# EAGLE design BLE-Shield-2_0_0_A1 (EAGLE 6.4)
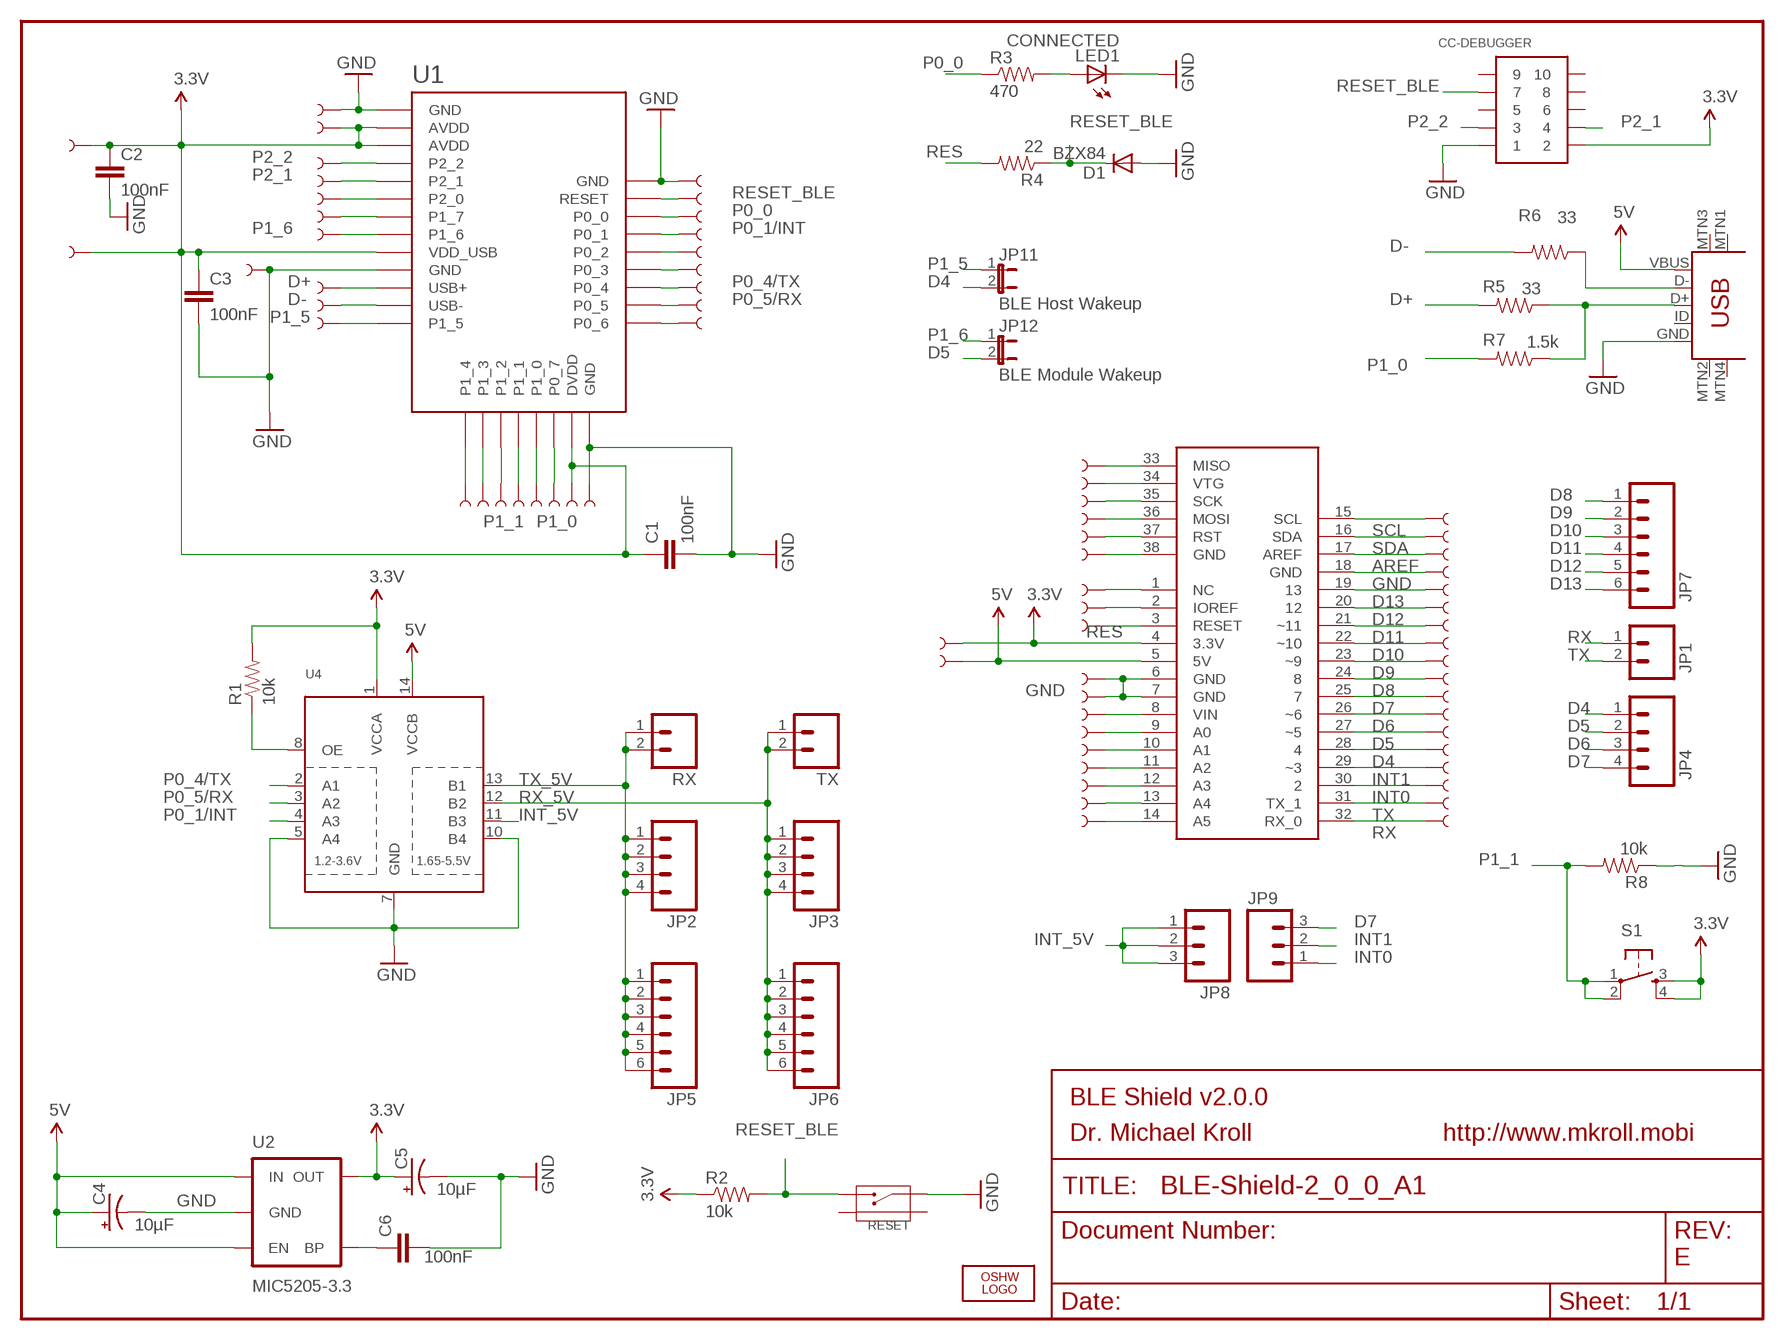
[diagram p0: schematic, sheet 1]

## Parts
C1  100nF  CAP0603-CAP  [0603-CAP]
C2  100nF  CAP0603-CAP  [0603-CAP]
C3  100nF  CAP0603-CAP  [0603-CAP]
C4  10µF  CAP_POL1206  [EIA3216]
C5  10µF  CAP_POL1206  [EIA3216]
C6  100nF  CAP0603-CAP  [0603-CAP]
CC-DEBUGGER  CONN_5-2-FTSH-V  [FTSH-105-DV]
D1  BZX84  DIODESOT23  [SOT23-3]
JP1  M02PTH  [1X02]
JP2  M04PTH  [1X04]
JP3  M04PTH  [1X04]
JP4  M04PTH  [1X04]
JP5  M06SIP  [1X06]
JP6  M06SIP  [1X06]
JP7  M06SIP  [1X06]
JP8  M03PTH  [1X03]
JP9  M03PTH  [1X03]
JP11  BLE Host Wakeup  JUMPER-2SMD-NO-NS  [SJ_2S-NO-NS]
JP12  BLE Module Wakeup  JUMPER-2SMD-NO-NS  [SJ_2S-NO-NS]
LED1  CONNECTED  LED0603  [LED-0603]
LOGO1  LOGO-OSHW-FILLX0200-NT  [OSHW_FILLX200_NOTEXT]
R1  10k  RESISTOR0603-RES  [0603-RES]
R2  10k  RESISTOR0603-RES  [0603-RES]
R3  470  RESISTOR0603-RES  [0603-RES]
R4  22  RESISTOR0603-RES  [0603-RES]
R5  33  RESISTOR0603-RES  [0603-RES]
R6  33  RESISTOR0603-RES  [0603-RES]
R7  1.5k  RESISTOR0603-RES  [0603-RES]
R8  10k  RESISTOR0603-RES  [0603-RES]
RESET  BUTTON-2P-REINFORCE-3100060P1  [4P-SMD-7.0X3.5X3.5H-90D]
RX  M02PTH  [1X02]
S1  TAC_SWITCHSMD  [TACTILE_SWITCH_SMD]
TP1  TEST-POINT3X5  [PAD.03X.05]
TP2  TEST-POINT3X5  [PAD.03X.05]
TP3  TEST-POINT3X5  [PAD.03X.05]
TP4  TEST-POINT3X5  [PAD.03X.05]
TP5  TEST-POINT3X5  [PAD.03X.05]
TP6  TEST-POINT3X5  [PAD.03X.05]
TP7  TEST-POINT3X5  [PAD.03X.05]
TP8  TEST-POINT3X5  [PAD.03X.05]
TP9  TEST-POINT3X5  [PAD.03X.05]
TP10  TEST-POINT3X5  [PAD.03X.05]
TP11  TEST-POINT3X5  [PAD.03X.05]
TP12  TEST-POINT3X5  [PAD.03X.05]
TP13  TEST-POINT3X5  [PAD.03X.05]
TP14  TEST-POINT3X5  [PAD.03X.05]
TP15  TEST-POINT3X5  [PAD.03X.05]
TP16  TEST-POINT3X5  [PAD.03X.05]
TP17  TEST-POINT3X5  [PAD.03X.05]
TP18  TEST-POINT3X5  [PAD.03X.05]
TP19  TEST-POINT3X5  [PAD.03X.05]
TP20  TEST-POINT3X5  [PAD.03X.05]
TP21  TEST-POINT3X5  [PAD.03X.05]
TP22  TEST-POINT3X5  [PAD.03X.05]
TP23  TEST-POINT3X5  [PAD.03X.05]
TP24  TEST-POINT3X5  [PAD.03X.05]
TP25  TEST-POINT3X5  [PAD.03X.05]
TP26  TEST-POINT3X5  [PAD.03X.05]
TP27  TEST-POINT3X5  [PAD.03X.05]
TP28  TEST-POINT3X5  [PAD.03X.05]
TP29  TEST-POINT3X5  [PAD.03X.05]
TP30  TEST-POINT3X5  [PAD.03X.05]
TP31  TEST-POINT3X5  [PAD.03X.05]
TP32  TEST-POINT3X5  [PAD.03X.05]
TP33  TEST-POINT3X5  [PAD.03X.05]
TP34  TEST-POINT3X5  [PAD.03X.05]
TP35  TEST-POINT3X5  [PAD.03X.05]
TP36  TEST-POINT3X5  [PAD.03X.05]
TP37  TEST-POINT3X5  [PAD.03X.05]
TP38  TEST-POINT3X5  [PAD.03X.05]
TP39  TEST-POINT3X5  [PAD.03X.05]
TP40  TEST-POINT3X5  [PAD.03X.05]
TP41  TEST-POINT3X5  [PAD.03X.05]
TP42  TEST-POINT3X5  [PAD.03X.05]
TP43  TEST-POINT3X5  [PAD.03X.05]
TP44  TEST-POINT3X5  [PAD.03X.05]
TP45  TEST-POINT3X5  [PAD.03X.05]
TP46  TEST-POINT3X5  [PAD.03X.05]
TP47  TEST-POINT3X5  [PAD.03X.05]
TP48  TEST-POINT3X5  [PAD.03X.05]
TP49  TEST-POINT3X5  [PAD.03X.05]
TP50  TEST-POINT3X5  [PAD.03X.05]
TP51  TEST-POINT3X5  [PAD.03X.05]
TP52  TEST-POINT3X5  [PAD.03X.05]
TP53  TEST-POINT3X5  [PAD.03X.05]
TP54  TEST-POINT3X5  [PAD.03X.05]
TP55  TEST-POINT3X5  [PAD.03X.05]
TP56  TEST-POINT3X5  [PAD.03X.05]
TP57  TEST-POINT3X5  [PAD.03X.05]
TP58  TEST-POINT3X5  [PAD.03X.05]
TP59  TEST-POINT3X5  [PAD.03X.05]
TP60  TEST-POINT3X5  [PAD.03X.05]
TP61  TEST-POINT3X5  [PAD.03X.05]
TP62  TEST-POINT3X5  [PAD.03X.05]
TP63  TEST-POINT3X5  [PAD.03X.05]
TP64  TEST-POINT3X5  [PAD.03X.05]
TP65  TEST-POINT3X5  [PAD.03X.05]
TP66  TEST-POINT3X5  [PAD.03X.05]
TP67  TEST-POINT3X5  [PAD.03X.05]
TP68  TEST-POINT3X5  [PAD.03X.05]
TX  M02PTH  [1X02]
U1  BLE112-A-VISUAL  [BLE112-A]
U2  MIC5205-3.3  V_REG_LDOSMD  [SOT23-5]
U4  TXB0104PWR  [TSSOP14]
U$5  ARDUINO_UNO_SHIELD_ICSP_PADS_ONLY  [ICSP_PADS_ONLY]
U$6  USB-MINIB-5PIN  [USB-MINIB]

## Nets
3.3V: C1.1 C2.1 C3.1 C5.A(+) CC-DEBUGGER.2 R1.2 R2.1 S1.3 S1.4 TP29.P$1 TP45.P$1 TP57.P$1 TP58.P$1 TP64.P$1 U1.AVDD1(AVDD) U1.AVDD2(AVDD) U1.DVDD U1.VDD_USB U2.5(OUT) U4.1(VCCA) U$5.4(3.3V)
5V: C4.A(+) TP46.P$1 U2.1(IN) U2.3(EN) U4.14(VCCB) U$5.5(5V) U$6.VBUS
AREF: TP3.P$1 U$5.17(AREF)
D4: JP4.1 JP11.2 TP14.P$1 U$5.28
D5: JP4.2 JP12.2 TP13.P$1 U$5.27(~5)
D6: JP4.3 TP12.P$1 U$5.26(~6)
D7: JP4.4 JP9.3 TP11.P$1 U$5.25
D8: JP7.1 TP10.P$1 U$5.24
D9: JP7.2 TP9.P$1 U$5.23(~9)
D10: JP7.3 TP8.P$1 U$5.22(~10)
D11: JP7.4 TP7.P$1 U$5.21(~11)
D12: JP7.5 TP6.P$1 U$5.20
D13: JP7.6 TP5.P$1 U$5.19
D+: R5.2 TP66.P$1 U1.USB+
D-: R6.2 TP67.P$1 U1.USB-
GND: C1.2 C2.2 C3.2 C4.C(-) C5.C(-) C6.2 CC-DEBUGGER.1 D1.1(A) LED1.C R8.1 RESET.1 TP4.P$1 TP19.P$1 TP28.P$1 TP47.P$1 TP48.P$1 TP54.P$1 TP65.P$1 U1.GND1(GND) U1.GND2(GND) U1.GND3(GND) U1.GND4(GND) U2.2(GND) U4.5(A4) U4.7(GND) U4.10(B4) U$5.6(GND) U$5.7(GND) U$5.18(GND) U$6.GND
INT0: JP9.1 TP16.P$1 U$5.30
INT1: JP9.2 TP15.P$1 U$5.29(~3)
INT_5V: JP8.1 JP8.2 JP8.3 U4.11(B3)
N$1: TP53.P$1 U$5.12(A3)
N$2: C6.1 U2.4(BP)
N$3: TP56.P$1 U$5.14(A5)
N$4: LED1.A R3.2
N$5: TP55.P$1 U$5.13(A4)
N$6: TP52.P$1 U$5.11(A2)
N$7: TP51.P$1 U$5.10(A1)
N$8: TP50.P$1 U$5.9(A0)
N$9: TP49.P$1 U$5.8(VIN)
N$12: R5.1 R7.1 U$6.D+
N$13: TP43.P$1 U$5.2(IOREF)
N$14: TP27.P$1 U1.P0_6
N$15: TP35.P$1 U1.P1_4
N$16: TP24.P$1 U1.P0_3
N$17: TP23.P$1 U1.P0_2
N$18: TP42.P$1 U$5.1(NC)
N$19: TP34.P$1 U1.P1_3
N$20: TP33.P$1 U1.P1_2
N$23: TP30.P$1 U1.P0_7
N$24: TP41.P$1 U$5.38(GND)
N$25: TP40.P$1 U$5.37(RST)
N$26: TP39.P$1 U$5.36(MOSI)
N$27: TP38.P$1 U$5.35(SCK)
N$28: TP37.P$1 U$5.34(VTG)
N$29: TP36.P$1 U$5.33(MISO)
N$30: R6.1 U$6.D-
N$31: TP61.P$1 U1.P2_0
N$32: TP62.P$1 U1.P1_7
N$37: R1.1 U4.8(OE)
P0_0: R3.1 TP21.P$1 U1.P0_0
P0_1/INT: TP22.P$1 U1.P0_1 U4.4(A3)
P0_4/TX: TP25.P$1 U1.P0_4 U4.2(A1)
P0_5/RX: TP26.P$1 U1.P0_5 U4.3(A2)
P1_0: R7.2 TP31.P$1 U1.P1_0
P1_1: R8.2 S1.1 S1.2 TP32.P$1 U1.P1_1
P1_5: JP11.1 TP68.P$1 U1.P1_5
P1_6: JP12.1 TP63.P$1 U1.P1_6
P2_1: CC-DEBUGGER.4 TP60.P$1 U1.P2_1
P2_2: CC-DEBUGGER.3 TP59.P$1 U1.P2_2
RES: R4.2 TP44.P$1 U$5.3(RESET)
RESET_BLE: CC-DEBUGGER.7 D1.3(C) R2.2 R4.1 RESET.2 TP20.P$1 U1.RESET
RX: JP1.1 TP18.P$1 U$5.32(RX_0)
RX_5V: JP3.1 JP3.2 JP3.3 JP3.4 JP6.1 JP6.2 JP6.3 JP6.4 JP6.5 JP6.6 TX.1 TX.2 U4.12(B2)
SCL: TP1.P$1 U$5.15(SCL)
SDA: TP2.P$1 U$5.16(SDA)
TX: JP1.2 TP17.P$1 U$5.31(TX_1)
TX_5V: JP2.1 JP2.2 JP2.3 JP2.4 JP5.1 JP5.2 JP5.3 JP5.4 JP5.5 JP5.6 RX.1 RX.2 U4.13(B1)
Unconnected: CC-DEBUGGER.5 CC-DEBUGGER.6 CC-DEBUGGER.8 CC-DEBUGGER.9 CC-DEBUGGER.10 RESET.S1 RESET.S2 U$6.ID U$6.MTN1(MTN2) U$6.MTN2(MTN3) U$6.MTN3(MTN1) U$6.MTN4

## Notes on the sheet
- BLE Shield v2.0.0
- Dr. Michael Kroll | http://www.mkroll.mobi
- E

## Library data of the parts
C1-C3 C6 = SparkFun-Capacitors:CAP: Capacitor Standard 0603 ceramic capacitor, and 0.1" leaded capacitor.
C4 C5 = SparkFun:CAP_POL: Capacitor Polarized These are standard SMD and PTH capacitors. Normally 10uF, 47uF, and 100uF in electrolytic and tantalum varieties. Always verify the external diameter of the through hole cap, it varies with capacity, voltage, and manufacturer. The EIA devices should be standard.
CC-DEBUGGER = pel_misc:CONN_5-2
D1 = SparkFun-DiscreteSemi:DIODE: Diode These are standard reverse protection diodes and small signal diodes. SMA package can handle up to about 1A. SOD-323 can handle about 200mA. What the SOD-323 package when ordering, there are some mfgs out there that are 5-pin packages.
JP1 RX TX = SparkFun-Connectors:M02: Header 2 Standard 2-pin 0.1" header. Use with straight break away headers (SKU : PRT-00116), right angle break away headers (PRT-00553), swiss pins (PRT-00743), machine pins (PRT-00117), and female headers (PRT-00115). Molex polarized connector foot print use with SKU : PRT-08233 with associated crimp pins and housings.
JP2-JP4 = SparkFun-Connectors:M04: Header 4 Standard 4-pin 0.1" header. Use with straight break away headers (SKU : PRT-00116), right angle break away headers (PRT-00553), swiss pins (PRT-00743), machine pins (PRT-00117), and female headers (PRT-00115). Molex polarized connector foot print use with SKU : PRT-08231 with associated crimp pins and housings. 1MM SMD Version SKU: PRT-10208
JP5-JP7 = SparkFun-Connectors:M06: Header 6 Standard 6-pin 0.1" header. Use with straight break away headers (SKU : PRT-00116), right angle break away headers (PRT-00553), swiss pins (PRT-00743), machine pins (PRT-00117), and female headers (PRT-00115). Molex polarized connector foot print use with SKU : PRT-08094 with associated crimp pins and housings. NOTES ON THE VARIANTS LOCK and LOCK_LONGPADS... This footprint was designed to help hold the alignment of a through-hole component (i.e. 6-pin header) while soldering it into place. You may notice that each hole has been shifted either up or down by 0.005 of an inch from it's more standard position (which is a perfectly straight line). This slight alteration caused the pins (the squares in the middle) to touch the edges of the holes. Because they are alternating, it causes a "brace" to hold the component in place. 0.005 has proven to be the perfect amount of "off-center" position when using our standard breakaway headers. Although looks a little odd when you look at the bare footprint, once you have a header in there, the alteration is very hard to notice. Also, if you push a header all the way into place, it is covered up entirely on the bottom side. This idea of altering the position of holes to aid alignment will be further integrated into the Sparkfun Library for other footprints. It can help hold any component with 3 or more connection pins.
JP8 JP9 = SparkFun-Connectors:M03: Header 3 Standard 3-pin 0.1" header. Use with straight break away headers (SKU : PRT-00116), right angle break away headers (PRT-00553), swiss pins (PRT-00743), machine pins (PRT-00117), and female headers (PRT-00115). Molex polarized connector foot print use with SKU : PRT-08232 with associated crimp pins and housings.
JP11 JP12 = SparkFun-Passives:JUMPER-2: Jumper Basic 0.1" spaced jumper. Use with breakaway headers.
LED1 = SparkFun-LED:LED: LEDs Standard schematic elements and footprints for 5mm, 3mm, 1206, and 0603 sized LEDs. 5mm - Spark Fun Electronics SKU : COM-00529 (and others)
LOGO1 = Logo:LOGO-OSHW-FILL
R1-R8 = SparkFun-Resistors:RESISTOR: Resistor Basic schematic elements and footprints for 0603, 1206, and PTH resistors.
RESET = OPL:BUTTON-2P-REINFORCE: TS-1188E http://www.best-dz.com/?thread-374-2.html SMD Button
S1 = SparkFun-Electromechanical:TAC_SWITCH: Momentary Switch Button commonly used for reset or general input. Spark Fun Electronics SKU : COM-00097 SMT- SWCH-08247; PROD_ID: SWCH-08247
TP1-TP68 = SparkFun-Passives:TEST-POINT: Bare copper test points for troubleshooting or ICT
U1 = sf-bluegiga:BLE112-A-VISUAL: Bluetooth Low Energy single-mode module - Bluetooth 4.0, chip antenna
U2 = SparkFun:V_REG_LDO: Voltage Regulator LDO Standard 150mA LDO voltage regulator in SOT-23 layout. Micrel part MIC5205. BP (by-pass) pin is used to lower output noise with 470pF cap.
U4 = SparkFun-DigitalIC:TXB0104PWR: 4-Bit Bi-Directional Level Shifter 1.2V-3.6V (VCCA) to 1.65V-5.5V (VCCB) bi-directional level shifter with auto direction sensing. Max data rate - VCCA 1.8V: 20Mbps (50ns), VCCA 3.3V: 100Mbps (10ns) Digikey: 296-21929-1-ND
U$5 = Arduino_Shields:ARDUINO_UNO_SHIELD_ICSP: Arduino Uno R3 Shield with ICSP header.
U$6 = SparkFun-Connectors:USB-MINIB: Mini-USB "B" connector with 5th pin broken out. Created new symbol breaking out 5th "ID" pin in mini/micro USB connector spec. See: http://en.wikipedia.org/wiki/Mini_usb#Cables. Uses same footprint as 4-pin symbol. Also added pins to connect to mounting / shield pads if required (probably not generally needed as signals aren't shielded once they leave the connector).

## Board
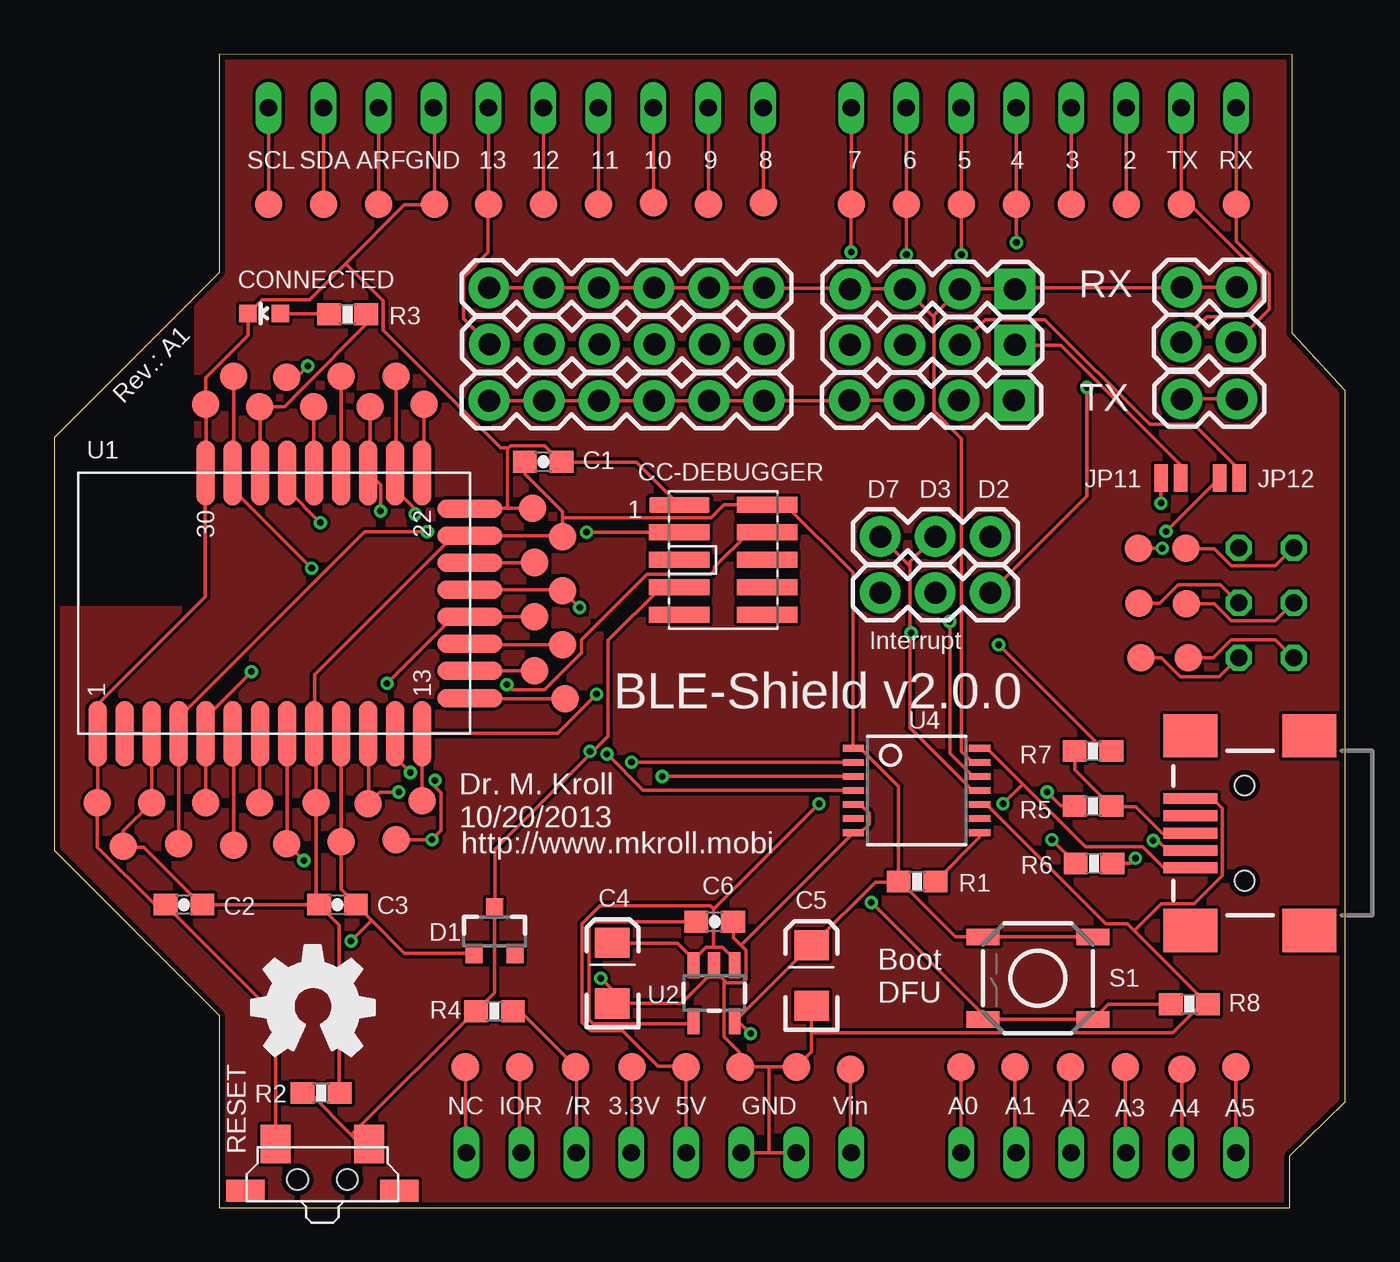
[diagram p1: board, top side]
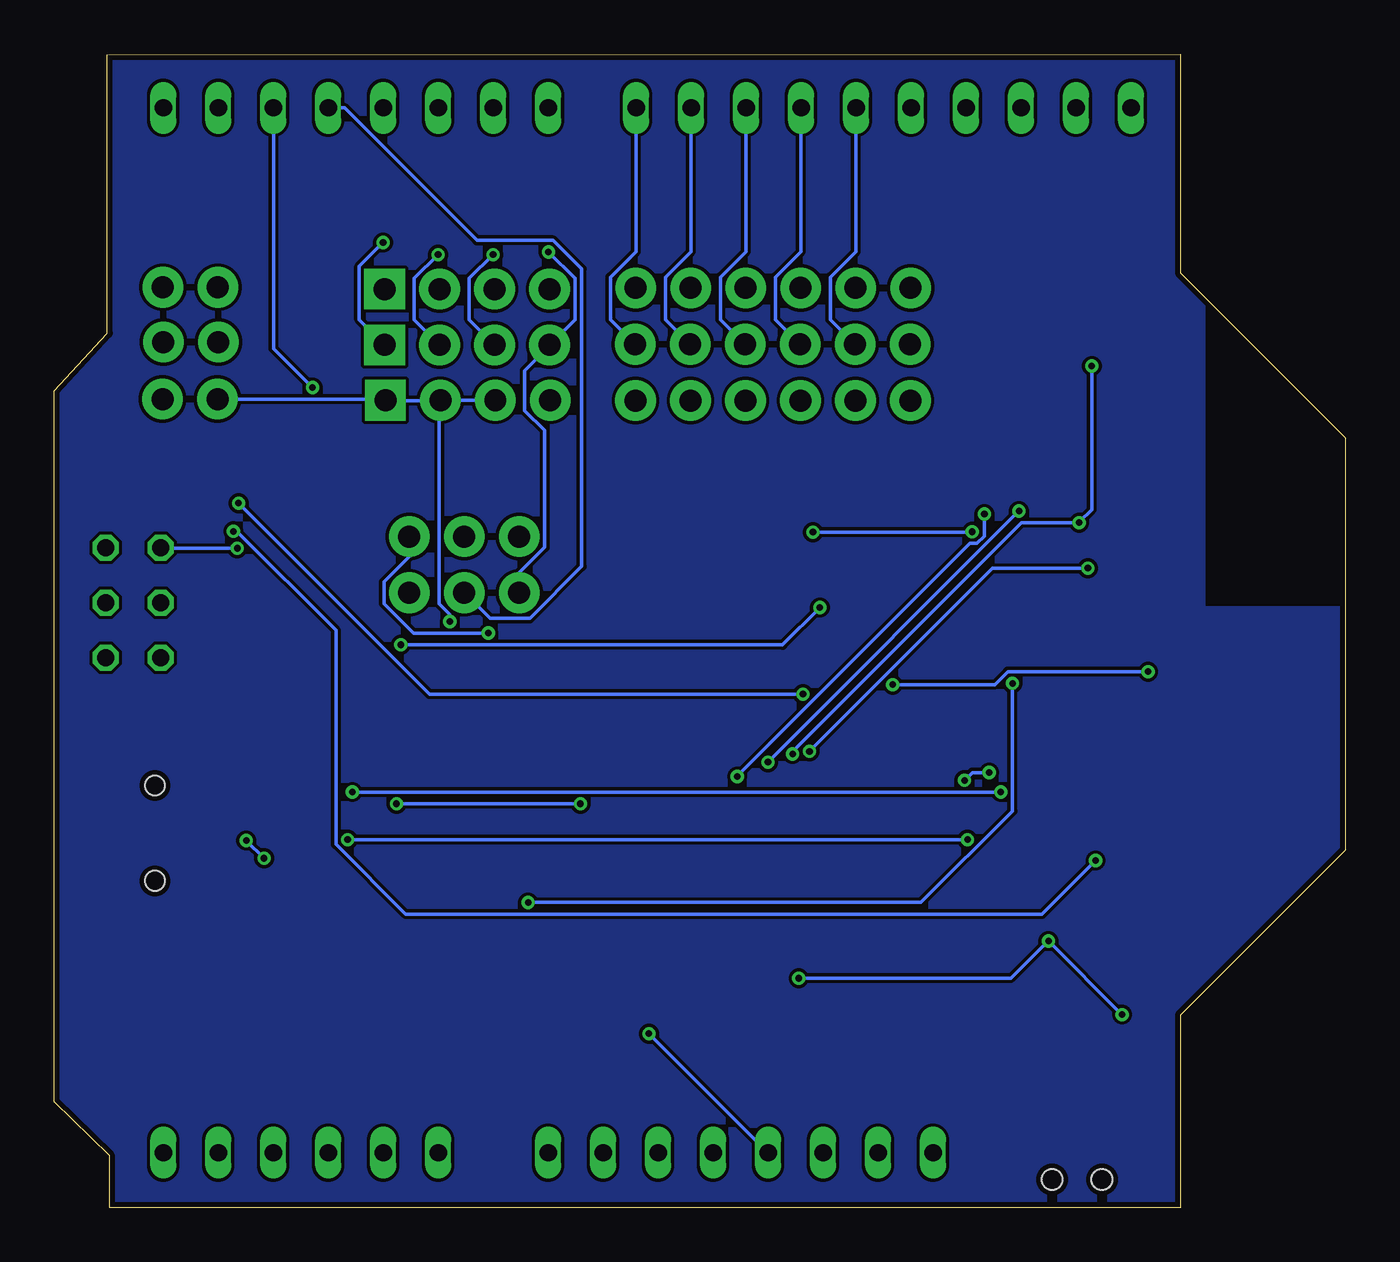
[diagram p2: board, bottom side, seen from below]

Size 59.66 x 53.28 mm. Coordinates in mm from the lower left corner, seen from the top.
Outline: 7.62,0 57.1,0 57.1,2.4 59.66,4.9 59.66,37.73 57.2,40.4 57.2,53.25 7.62,53.28 7.62,43.18 0,35.56 0,16.51 7.62,8.89 7.62,0
Copper layers (1*2*15*16): Top 0.035mm / dielectric 0.2mm / layer 2 0.0175mm / dielectric 1.1mm / layer 15 0.0175mm / dielectric 0.2mm / Bottom 0.035mm
Design rules "SeeedStudio_DRU_no_angle_20130527": minimum track width 6mil, minimum drill 12mil, track to track 6mil, track to pad 6mil, pad to pad 6mil, via to via 6mil, smd to smd 0mil, copper to edge 10mil, drill to drill 10mil, minimum pad ring 6mil, minimum via ring 6mil, stop-mask expansion 2mil, vias tented up to drill 25mil, thermal gap 10mil
tKeepout: area 0.1,23.6 to 17.5,32.2
bKeepout: area 0.1,23.6 to 17.5,32.2
tRestrict: area 0,27.8 to 6.5,42
bRestrict: area 0,27.8 to 6.5,41.9

### Footprints (pad centres in the part's own frame; a part is rotated, then mirrored left to right if it is on the bottom)
0603-CAP = smd 1.1 x 1: 1 -0.85,0; 2 0.85,0
EIA3216 = smd 1.4 x 1.6: A 1.4,0; C -1.4,0
FTSH-105-DV = smd 0.74 x 2.8: 1 -2.54,-2.03; 2 -2.54,2.03; 3 -1.27,-2.03; 4 -1.27,2.03; 5 0,-2.03; 6 0,2.03; 7 1.27,-2.03; 8 1.27,2.03; 9 2.54,-2.03; 10 2.54,2.03
SOT23-3 = smd 0.8 x 0.9: 1 -0.95,-1; 2 0.95,-1; 3 0,1.1
1X02 = drill 1.016 pad 1.88: 1 0,0; 2 2.54,0
1X04 = drill 1.016 pad 1.88 square: 1 0,0 | drill 1.016 pad 1.88: 2 2.54,0; 3 5.08,0; 4 7.62,0
1X06 = drill 1.016 pad 1.88: 1 0,0; 2 2.54,0; 3 5.08,0; 4 7.62,0; 5 10.16,0; 6 12.7,0
1X03 = drill 1.016 pad 1.88: 1 0,0; 2 2.54,0; 3 5.08,0
SJ_2S-NO-NS = smd 0.635 x 1.27: 1 -0.45,0; 2 0.45,0
LED-0603 = smd 0.8 x 0.8: A 0,-0.75; C 0,0.75
0603-RES = smd 1.1 x 1: 1 -0.85,0; 2 0.85,0
4P-SMD-7.0X3.5X3.5H-90D = smd 1.397 x 1.778: 1 -2.159,1.651; 2 2.159,1.651 | smd 1.778 x 1.016: S1 -3.556,-0.508; S2 3.556,-0.508 | hole 0.95: -1.15,0; 1.15,0
TACTILE_SWITCH_SMD = smd 1.524 x 0.762: 1 -2.54,1.905; 2 2.54,1.905; 3 -2.54,-1.905; 4 2.54,-1.905
PAD.03X.05 = smd 1.27 x 1.27: P$1 0,0
BLE112-A = smd 3 x 0.85: AVDD1 -6.05,6.9; AVDD2 -6.05,5.65; GND1 -6.05,8.15; GND2 -6.05,-3.1; GND4 6,3.15; P0_0 6,0.65; P0_1 6,-0.6; P0_2 6,-1.85; P0_3 6,-3.1; P0_4 6,-4.35; P0_5 6,-5.6; P0_6 6,-6.85; P1_5 -6.05,-6.85; P1_6 -6.05,-0.6; P1_7 -6.05,0.65; P2_0 -6.05,1.9; P2_1 -6.05,3.15; P2_2 -6.05,4.4; RESET 6,1.9; USB+ -6.05,-4.35; USB- -6.05,-5.6; VDD_USB -6.05,-1.85 | smd 0.85 x 3: DVDD 3.1,-9.05; GND3 4.35,-9.05; P0_7 1.85,-9.05; P1_0 0.6,-9.05; P1_1 -0.65,-9.05; P1_2 -1.9,-9.05; P1_3 -3.15,-9.05; P1_4 -4.4,-9.05
SOT23-5 = smd 0.55 x 1.2: 1 -0.95,-1.3; 2 0,-1.3; 3 0.95,-1.3; 4 0.95,1.3; 5 -0.95,1.3
TSSOP14 = smd 0.305 x 0.991: 1 -1.95,-2.918; 2 -1.3,-2.918; 3 -0.65,-2.918; 4 0,-2.918; 5 0.65,-2.918; 6 1.3,-2.918; 7 1.95,-2.918; 8 1.95,2.918; 9 1.3,2.918; 10 0.65,2.918; 11 0,2.918; 12 -0.65,2.918; 13 -1.3,2.918; 14 -1.95,2.918
ICSP_PADS_ONLY = drill 0.8 long: 1 27.94,2.54; 2 30.48,2.54; 3 33.02,2.54; 4 35.56,2.54; 5 38.1,2.54; 6 40.64,2.54; 7 43.18,2.54; 8 45.72,2.54; 9 50.8,2.54; 10 53.34,2.54; 11 55.88,2.54; 12 58.42,2.54; 13 60.96,2.54; 14 63.5,2.54; 15 18.796,50.8; 16 21.336,50.8; 17 23.876,50.8; 18 26.416,50.8; 19 28.956,50.8; 20 31.496,50.8; 21 34.036,50.8; 22 36.576,50.8; 23 39.116,50.8; 24 41.656,50.8; 25 45.72,50.8; 26 48.26,50.8; 27 50.8,50.8; 28 53.34,50.8; 29 55.88,50.8; 30 58.42,50.8; 31 60.96,50.8; 32 63.5,50.8 | drill 0.8 octagon: 33 63.627,30.48; 34 66.167,30.48; 35 63.627,27.94; 36 66.167,27.94; 37 63.627,25.4; 38 66.167,25.4
USB-MINIB = smd 2.5 x 0.5: D+ 2.5,0; D- 2.5,0.8; GND 2.5,-1.6; ID 2.5,-0.8; VBUS 2.5,1.6 | smd 2.5 x 2: MTN1 -3,4.5; MTN2 2.5,4.5; MTN3 -3,-4.5; MTN4 2.5,-4.5 | hole 0.9: 0,2.2; 0,-2.2

### Placement (x,y rotation side)
C1  22.59,34.45 0 top
C2  6,14 180 top
C3  13.09,14 0 top
C4  25.79,10.84 90 top
C5  34.99,10.72 90 top
C6  30.52,13.21 0 top
CC-DEBUGGER  30.92,29.92 270 top
D1  20.35,12.75 0 top
JP1  54.61,39.98 180 top
JP2  44.39,42.43 180 top
JP3  44.35,37.29 180 top
JP4  44.39,39.85 180 top
JP5  32.79,42.48 180 top
JP6  32.8,37.28 180 top
JP7  32.81,39.88 180 top
JP8  43.25,31 180 top
JP9  43.25,28.4 180 top
JP11  51.6,33.7 0 top
JP12  54.3,33.7 0 top
LED1  9.71,41.3 90 top
LOGO1  9.12,7.01 0 top
R1  39.88,15.07 180 top
R2  12.34,5.3 180 top
R3  13.56,41.27 180 top
R4  20.34,9.07 0 top
R5  48,18.55 180 top
R6  48.05,15.9 180 top
R7  48,21.1 0 top
R8  52.45,9.4 180 top
RESET  12.4,1.3 0 top
RX  52.09,42.52 0 top
S1  45.45,10.6 180 top
TP1  9.91,46.35 0 top
TP2  12.45,46.35 0 top
TP3  14.99,46.35 0 top
TP4  17.58,46.35 0 top
TP5  20.07,46.35 0 top
TP6  22.61,46.35 0 top
TP7  25.15,46.35 0 top
TP8  27.69,46.41 0 top
TP9  30.23,46.35 0 top
TP10  32.77,46.41 90 top
TP11  36.83,46.35 0 top
TP12  39.37,46.35 0 top
TP13  41.91,46.35 0 top
TP14  44.45,46.35 0 top
TP15  46.99,46.35 0 top
TP16  49.53,46.35 0 top
TP17  52.07,46.35 0 top
TP18  54.61,46.35 0 top
TP19  7,37.1 0 top
TP20  8.3,38.4 0 top
TP21  9.5,37 0 top
TP22  10.75,38.35 0 top
TP23  12,37 0 top
TP24  13.25,38.4 0 top
TP25  14.6,37 0 top
TP26  15.8,38.4 0 top
TP27  17.1,37.1 0 top
TP28  22.1,32.3 0 top
TP29  23.5,31 0 top
TP30  22.2,29.8 0 top
TP31  23.5,28.5 0 top
TP32  22.2,27.3 0 top
TP33  23.5,26 0 top
TP34  22.2,24.8 0 top
TP35  23.6,23.5 0 top
TP36  50.09,30.45 0 top
TP37  52.3,30.45 0 top
TP38  50.12,27.92 0 top
TP39  52.3,27.9 0 top
TP40  50.2,25.4 0 top
TP41  52.4,25.4 0 top
TP42  19,6.5 0 top
TP43  21.5,6.5 0 top
TP44  24.1,6.5 0 top
TP45  26.7,6.5 0 top
TP46  29.2,6.5 0 top
TP47  31.7,6.5 0 top
TP48  34.3,6.5 0 top
TP49  36.8,6.4 0 top
TP50  41.9,6.5 0 top
TP51  44.4,6.5 0 top
TP52  46.95,6.5 0 top
TP53  49.5,6.5 0 top
TP54  2,18.7 0 top
TP55  52.1,6.4 0 top
TP56  54.6,6.5 0 top
TP57  3.2,16.7 0 top
TP58  4.5,18.7 0 top
TP59  5.75,16.8 0 top
TP60  7,18.7 0 top
TP61  8.3,16.75 0 top
TP62  9.5,18.7 0 top
TP63  10.75,16.8 0 top
TP64  12.1,18.7 90 top
TP65  13.25,16.9 0 top
TP66  14.5,18.65 0 top
TP67  15.8,17 0 top
TP68  17,18.8 0 top
TX  52.11,37.35 0 top
U1  10.16,27.94 90 top
U2  30.5,9.91 180 top
U4  39.85,19.27 270 top
U$5  -8.89,0 0 top
U$6  55,17.3 180 top

### Tracks (layer width: path | path; a pad name or v marks a point on that pad's centre or on a via)
3.3V  (via drill 0.3)
  Top 0.152: S1.3 47.98,12.52 42.92,12.52 S1.4 42.84,12.52 41.64,12.52 39.1,15.06 R1.2 | R1.2 39.02,19.46 37.26,21.22 U4.1 36.9,21.28 36.9,29.34 33.8,32.44 33.02,32.44 CC-DEBUGGER.2 30.94,32.46 30.34,31.86 23.5,31.86 | TP45.P$1 26.7,2.56 U$5.4 | v32.18,8.04 31.58,8.64 U2.5 34.98,12.14 C5.A 35.06,12.16 37.94,15.04 38.96,15.04 R1.2 | 23.5,31.86 TP29.P$1 23.44,31.04 U1.DVDD 19.14,31.02 18.44,31.02 12.04,24.62 12.04,21.96 U1.VDD_USB 12.1,21.8 TP64.P$1 12.1,14.06 C3.1 | 23.5,31.86 23.5,32.14 21.76,33.88 21.76,34.44 C1.1 | U1.AVDD1 4.44,21.9 U1.AVDD2 TP58.P$1 3.2,17.4 TP57.P$1 3.26,16.66 4.14,16.66 6.78,14.02 C2.1 C3.1 | R2.1 13.18,13.04 12.28,13.94 C3.1
  Bottom 0.152: v32.18,8.04 U$5.4
5V  (via drill 0.3)
  Top 0.152: U4.14 43.1,21.22 44.75,19.57 | 44.75,19.57 47.64,16.68 50.3,16.68 51.28,15.7 U$6.VBUS | U$5.5 TP46.P$1 29.14,6.54 27.9,6.54 26.26,8.18 24.78,8.18 24.4,8.56 24.4,13.12 25.22,13.94 30.32,13.94 30.46,13.8 | 30.46,12.04 30.88,12.04 31.44,11.48 U2.1 | 30.46,12.04 30.12,12.04 29.56,11.48 U2.3 29.5,11.52 28.8,12.22 25.8,12.22 C4.A | 30.46,12.04 30.46,13.8 | v43.84,18.66 44.75,19.57 | v35.34,18.66 30.52,13.84 30.46,13.8
  Bottom 0.152: v35.34,18.66 v43.84,18.66
AREF
  Top 0.152: TP3.P$1 U$5.17
D4  (via drill 0.3)
  Top 0.152: U$5.28 TP14.P$1 44.46,46.28 v44.46,44.58 | JP11.2 52.04,34.32 46.52,39.84 JP4.1
  Bottom 0.152: v44.46,44.58 45.56,43.48 45.56,41.02 JP4.1
D5  (via drill 0.3)
  Top 0.152: U$5.27 TP13.P$1 41.92,46.28 v41.92,44.02 | JP4.2 43.02,41.02 45.78,41.02 50.62,36.18 52.66,36.18 54.74,34.1 JP12.2
  Bottom 0.152: v41.92,44.02 43.02,42.92 43.02,41.02 JP4.2
D6  (via drill 0.3)
  Top 0.152: U$5.26 TP12.P$1 39.38,46.28 v39.38,44.02
  Bottom 0.152: v39.38,44.02 40.48,42.92 40.48,41.02 JP4.3
D7  (via drill 0.3)
  Top 0.152: U$5.25 TP11.P$1 36.82,46.28 v36.82,44.14
  Bottom 0.152: v36.82,44.14 35.6,42.92 35.6,41.02 JP4.4 36.8,39.78 37.92,38.66 37.92,36.82 37,35.9 37,30.5 38.16,29.34 JP9.3
D8
  Top 0.152: TP10.P$1 U$5.24
  Bottom 0.152: U$5.24 32.78,44.16 33.96,42.98 33.96,41.02 JP7.1
D9
  Top 0.152: TP9.P$1 U$5.23
  Bottom 0.152: U$5.23 30.24,44.16 31.42,42.98 31.42,41.02 JP7.2
D10
  Top 0.152: TP8.P$1 U$5.22
  Bottom 0.152: U$5.22 27.7,44.16 28.88,42.98 28.88,41.02 JP7.3
D11
  Top 0.152: TP7.P$1 U$5.21
  Bottom 0.152: U$5.21 25.16,44.16 26.34,42.98 26.34,41.02 JP7.4
D12
  Top 0.152: TP6.P$1 U$5.20
  Bottom 0.152: U$5.20 22.62,44.16 23.8,42.98 23.8,41.02 JP7.5
D13
  Top 0.152: U$5.19 TP5.P$1 20.06,46.28 20.06,44.12 18.92,42.98 18.92,41.06 JP7.6
D+  (via drill 0.3)
  Top 0.152: v45.88,19.2 46.52,18.56 R5.2 | v15.92,19.2 15.04,19.2 TP66.P$1 14.52,18.78 U1.USB+
  Bottom 0.152: v15.92,19.2 v45.88,19.2
D-  (via drill 0.3)
  Top 0.152: v46.1,17 R6.2 | TP67.P$1 v17.46,17 17.5,17.06 17.88,17.44 17.88,19.16 17.6,19.44 v17.6,19.74 | U1.USB- 15.76,20.8 v16.46,20.1
  Bottom 0.152: v17.46,17 v46.1,17 | v16.46,20.1 17.24,20.1 v17.6,19.74
GND  (via drill 0.3)
  Top 0.152: U4.10 43.1,18.62 48.6,13.12 49.58,13.12 49.91,12.79 | 49.91,12.79 R8.1 53.1,9.5 51.68,8.08 34.98,8.08 | U$6.GND 53.54,18.9 53.98,18.46 53.98,15.34 52.68,14.04 51.16,14.04 49.91,12.79 | U$5.7 33.02,2.54 | 33.02,2.54 U$5.6 | 33.02,6.5 TP48.P$1 34.34,6.56 34.98,7.2 34.98,8.08 | 33.02,6.5 TP47.P$1 31.66,6.56 31.66,7.18 30.94,7.9 30.94,10.4 30.99,10.45 | 34.98,8.08 C5.C | 33.02,6.5 33.02,2.54 | U4.5 37.26,18.62 37.66,18.22 37.66,17.72 37.26,17.32 U4.7 36.88,17.28 31.73,12.13 | 31.73,12.13 31.96,11.9 31.96,10.52 31.82,10.38 31.06,10.38 30.99,10.45 | 31.73,12.13 31.38,12.48 C6.2 | 30.99,10.45 30.5,10.94 U2.2 30.44,10.9 28.98,9.44 C4.C 25.8,9.52 25.8,10.06 v25.26,10.6 | 14.67,13.27 C3.2 13.9,14.06 13.26,14.7 TP65.P$1 13.26,16.96 U1.GND2 | 14.67,13.27 16.18,11.76 D1.1 | 10.24,8.88 RESET.1 | 10.24,8.88 5.18,13.94 C2.2 4.66,14 2,16.66 TP54.P$1 2.02,18.76 U1.GND1 2.04,21.96 2.04,23.28 6.98,28.22 6.98,33.88 U1.GND4 7.02,37.04 TP19.P$1 7,38.34 8.96,40.3 LED1.C 9.02,41.34 9.62,41.94 11.8,41.94 13.47,43.61 | v13.72,12.32 14.67,13.27 | v10.32,8.92 10.3,8.92 10.24,8.88 | 20.96,32.3 U1.GND3 | 20.96,32.3 TP28.P$1 | CC-DEBUGGER.1 26.9,34.44 C1.2 23.38,34.48 22.66,35.2 21.1,35.2 20.96,35.06 | 20.96,35.06 20.96,32.3 | U$5.18 17.58,50.76 TP4.P$1 17.52,46.32 16.18,46.32 13.47,43.61 | 13.47,43.61 15.2,41.88 15.2,40.52 20.62,35.1 20.9,35.1 20.96,35.06
  Bottom 0.152: v10.32,8.92 v13.72,12.32 13.78,12.28 15.46,10.6 v25.26,10.6
INT0  (via drill 0.3)
  Top 0.152: TP16.P$1 U$5.30 | v47.72,37.88 47.72,32.86 JP9.1
  Bottom 0.152: v47.72,37.88 49.52,39.68 U$5.30
INT1
  Top 0.152: TP15.P$1 U$5.29
  Bottom 0.152: U$5.29 46.24,50.8 40.12,44.68 36.6,44.68 35.28,43.36 35.28,29.62 37.68,27.22 39.52,27.22 JP9.2
INT_5V  (via drill 0.3)
  Top 0.152: 39.54,29.7 39.54,29.84 JP8.2 | 39.54,29.7 39.54,26.54 | 39.54,26.54 39.54,22.16 42.42,19.28 U4.11 | JP8.3 39.48,29.7 39.54,29.7 | v39.6,26.54 39.54,26.54
  Bottom 0.152: v39.6,26.54 43.06,26.54 44.42,27.9 44.42,28.9 43.26,30.06 JP8.1
N$1
  Top 0.152: TP53.P$1 49.5,2.56 U$5.12
N$2
  Top 0.152: C6.1 24.92,13.2 24.72,13 24.72,8.68 24.9,8.5 29.44,8.5 U2.4
N$3
  Top 0.152: TP56.P$1 U$5.14
N$4
  Top 0.152: LED1.A 12.68,41.3 R3.2
N$5
  Top 0.152: TP55.P$1 52.1,2.56 U$5.13
N$6
  Top 0.152: TP52.P$1 46.96,2.56 U$5.11
N$7
  Top 0.152: TP51.P$1 44.4,2.58 U$5.10
N$8
  Top 0.152: TP50.P$1 U$5.9
N$9
  Top 0.152: TP49.P$1 36.8,2.56 U$5.8
N$10
  pour Bottom: 7.6,53.25 57.25,53.25 57.25,40.4 59.65,37.7 59.65,4.9 57.1,2.4 57.1,0 7.6,0 7.65,8.75 0,16.4 0,35.65 7.6,43.15
N$11
  pour Top: 7.6,53.25 57.2,53.2 57.25,40.4 59.65,37.65 59.6,4.85 57.1,2.35 57.05,0 7.6,0 7.6,8.7 0,16.55 0.05,35.6 7.6,43.2
N$12
  Top 0.152: R7.1 47.16,20.24 R5.1 48.92,18.52 49.98,18.52 51.2,17.3 U$6.D+
N$13
  Top 0.152: TP43.P$1 21.5,2.62 U$5.2
N$14
  Top 0.152: TP27.P$1 17.1,34.02 U1.P0_6
N$15
  Top 0.152: TP35.P$1 19.26,23.5 U1.P1_4
N$16
  Top 0.152: U1.P0_3 TP24.P$1
N$17
  Top 0.152: TP23.P$1 U1.P0_2
N$18
  Top 0.152: TP42.P$1 19,2.58 U$5.1
N$19
  Top 0.152: TP34.P$1 U1.P1_3
N$20
  Top 0.152: TP33.P$1 19.26,26 U1.P1_2
N$23
  Top 0.152: TP30.P$1 U1.P0_7
N$24
  Top 0.152: TP41.P$1 53.56,25.4 54.4,26.24 56.42,26.24 57.26,25.4 U$5.38
N$25
  Top 0.152: TP40.P$1 51.16,25.4 52.04,24.52 53.84,24.52 54.72,25.4 U$5.37
N$26
  Top 0.152: TP39.P$1 53.6,27.9 54.4,27.1 56.42,27.1 57.26,27.94 U$5.36
N$27
  Top 0.152: TP38.P$1 51.08,27.92 51.94,28.78 53.88,28.78 54.72,27.94 U$5.35
N$28
  Top 0.152: TP37.P$1 53.6,30.44 54.4,29.64 56.42,29.64 57.26,30.48 U$5.34
N$29  (via drill 0.3)
  Top 0.152: v51.2,30.46 TP36.P$1
  Bottom 0.152: v51.2,30.46 54.7,30.46 54.72,30.48 U$5.33
N$30  (via drill 0.3)
  Top 0.152: R6.1 49.72,15.9 v49.96,16.14 | v50.78,16.96 51,16.96 51.46,16.5 U$6.D-
  Bottom 0.152: v50.78,16.96 v49.96,16.14
N$31
  Top 0.152: TP61.P$1 8.3,21.84 U1.P2_0
N$32
  Top 0.152: TP62.P$1 U1.P1_7
N$37
  Top 0.152: U4.8 42.76,17.1 R1.1
P0_0
  Top 0.152: R3.1 14.4,40.78 11.5,37.88 11.5,37.86 10.64,37 TP21.P$1 9.52,36.94 U1.P0_0
P0_1/INT  (via drill 0.3)
  Top 0.152: v25.54,20.96 27.22,19.28 U4.4 | v12.3,31.64 10.76,33.18 U1.P0_1 | v11.72,38.88 11.2,38.36 TP22.P$1
  Bottom 0.152: v25.54,20.96 25.54,21.06 14.96,31.64 v12.3,31.64 12.26,31.7 11.72,32.24 v11.72,38.88
P0_4/TX  (via drill 0.3)
  Top 0.152: v26.68,20.58 U4.2 | v15.08,32.18 15.08,33.38 U1.P0_4 14.6,33.96 TP25.P$1
  Bottom 0.152: v15.08,32.18 v26.68,20.58
P0_5/RX  (via drill 0.3)
  Top 0.152: v28.1,19.92 U4.3 | v16.68,32.04 16.68,32.26 15.76,33.18 U1.P0_5 15.8,34 TP26.P$1
  Bottom 0.152: v28.1,19.92 17.34,30.68 17.02,30.68 16.68,31.02 v16.68,32.04
P1_0  (via drill 0.3)
  Top 0.152: R7.2 48.54,21.1 v43.64,26 | v24.28,27.72 TP31.P$1 23.44,28.54 U1.P1_0
  Bottom 0.152: v43.64,26 26,26 v24.28,27.72
P1_1  (via drill 0.3)
  Top 0.152: TP32.P$1 U1.P1_1 19.14,27.26 18.42,27.26 v15.38,24.22 | R8.2 48.7,9.4 S1.1 47.92,8.7 S1.2 43.1,8.76 v37.76,14.1
  Bottom 0.152: v15.38,24.22 15.38,18.32 19.6,14.1 v37.76,14.1
P1_5  (via drill 0.3)
  Top 0.152: TP68.P$1 U1.P1_5 17.08,21.92 23.26,21.92 v25.06,23.72 | v51.14,32.54 JP11.1
  Bottom 0.152: v51.14,32.54 42.32,23.72 v25.06,23.72
P1_6  (via drill 0.3)
  Top 0.152: U1.P1_6 TP63.P$1 10.82,16.76 v11.54,16.04 | v51.38,31.24 JP12.1
  Bottom 0.152: v51.38,31.24 51.22,31.24 46.64,26.66 46.64,16.78 43.42,13.56 14.02,13.56 v11.54,16.04
P2_1  (via drill 0.3)
  Top 0.152: TP60.P$1 U1.P2_1 7.04,21.96 7.04,22.68 v9.12,24.76 | v20.92,24.16 21.16,23.92 22.66,23.92 24.38,25.64 24.38,26.24 27.4,29.26 30.34,29.26 30.52,29.44 30.52,29.6 32.1,31.18 CC-DEBUGGER.4
  Bottom 0.152: v20.92,24.16 16.2,24.16 15.6,24.76 v9.12,24.76
P2_2  (via drill 0.3)
  Top 0.152: TP59.P$1 U1.P2_2 5.78,21.96 5.78,22.66 14.34,31.22 v17.24,31.22 | v24.6,31.2 CC-DEBUGGER.3
  Bottom 0.152: v24.6,31.2 17.26,31.2 v17.24,31.22
RES
  Top 0.152: R4.2 21.54,9.06 TP44.P$1 24.14,6.44 U$5.3
RESET_BLE  (via drill 0.3)
  Top 0.152: TP20.P$1 8.3,33.98 U1.RESET 8.3,33.88 8.3,33.14 v11.9,29.54 | R2.2 11.8,5.3 13.73,3.37 | 13.73,3.37 14.14,2.96 14.54,2.96 RESET.2 | 24.83,21.01 20.38,16.56 20.38,13.92 D1.3 20.34,9.92 R4.1 19.42,9.06 13.73,3.37 | 24.83,21.01 25.6,21.78 25.6,26.2 28.04,28.64 CC-DEBUGGER.7 | v24.76,21.08 24.83,21.01
  Bottom 0.152: v11.9,29.54 16.3,29.54 v24.76,21.08
RX
  Top 0.152: U$5.32 TP18.P$1 54.62,46.28 54.62,44.64 56.14,43.12 56.14,41.5 JP1.1
RX_5V  (via drill 0.3)
  Top 0.152: JP6.6 JP6.5 JP6.4 JP6.3 JP6.2 JP6.1 36.66,37.28 JP3.4 JP3.3 | TX.1 TX.2 | U4.12 42.44,19.92 41.38,20.98 v41.38,27.08
  Bottom 0.152: v41.38,27.08 41.38,27.4 41.88,27.9 41.88,37.22 JP3.2 | JP3.2 41.92,37.28 JP3.1 44.4,37.34 TX.1 | JP3.3 41.74,37.3 JP3.2
SCL
  Top 0.152: TP1.P$1 U$5.15
SDA
  Top 0.152: TP2.P$1 U$5.16
TX
  Top 0.152: U$5.31 TP17.P$1 52.16,46.36 52.46,46.36 55.82,43 55.82,42.04 54.94,41.16 53.26,41.16 JP1.2
TX_5V
  Top 0.152: JP5.6 JP5.5 JP5.4 JP5.3 JP5.2 JP5.1 32.86,42.46 36.7,42.46 JP2.4 JP2.3 39.38,42.4 40.58,41.2 40.64,41.2 | RX.2 RX.1 52.02,42.5 44.42,42.5 JP2.1 41.92,42.44 JP2.2 40.64,41.22 40.64,41.2 | 40.64,41.2 40.64,36.8 41.92,35.52 41.92,21.08 42.42,20.58 U4.13

### Text on the board
tNames: SCL | SDA | ARF | GND | 13 | 12 | 11 | 10 | 9 | 8 | 7 | 6 | 5 | 4 | 3 | 2 | TX | RX | Rev.: A1 | D7 | D3 | D2 | 1 | Interrupt | BLE-Shield v2.0.0 | Dr. M. Kroll / 10/20/2013 | http://www.mkroll.mobi | Boot / DFU | NC | IOR | /R | 3.3V | 5V | GND | Vin | A0 | A1 | A2 | A3 | A4 | A5